# EAGLE design tick-ds3231-breakout-mk-2.1 (EAGLE 6.5.0)
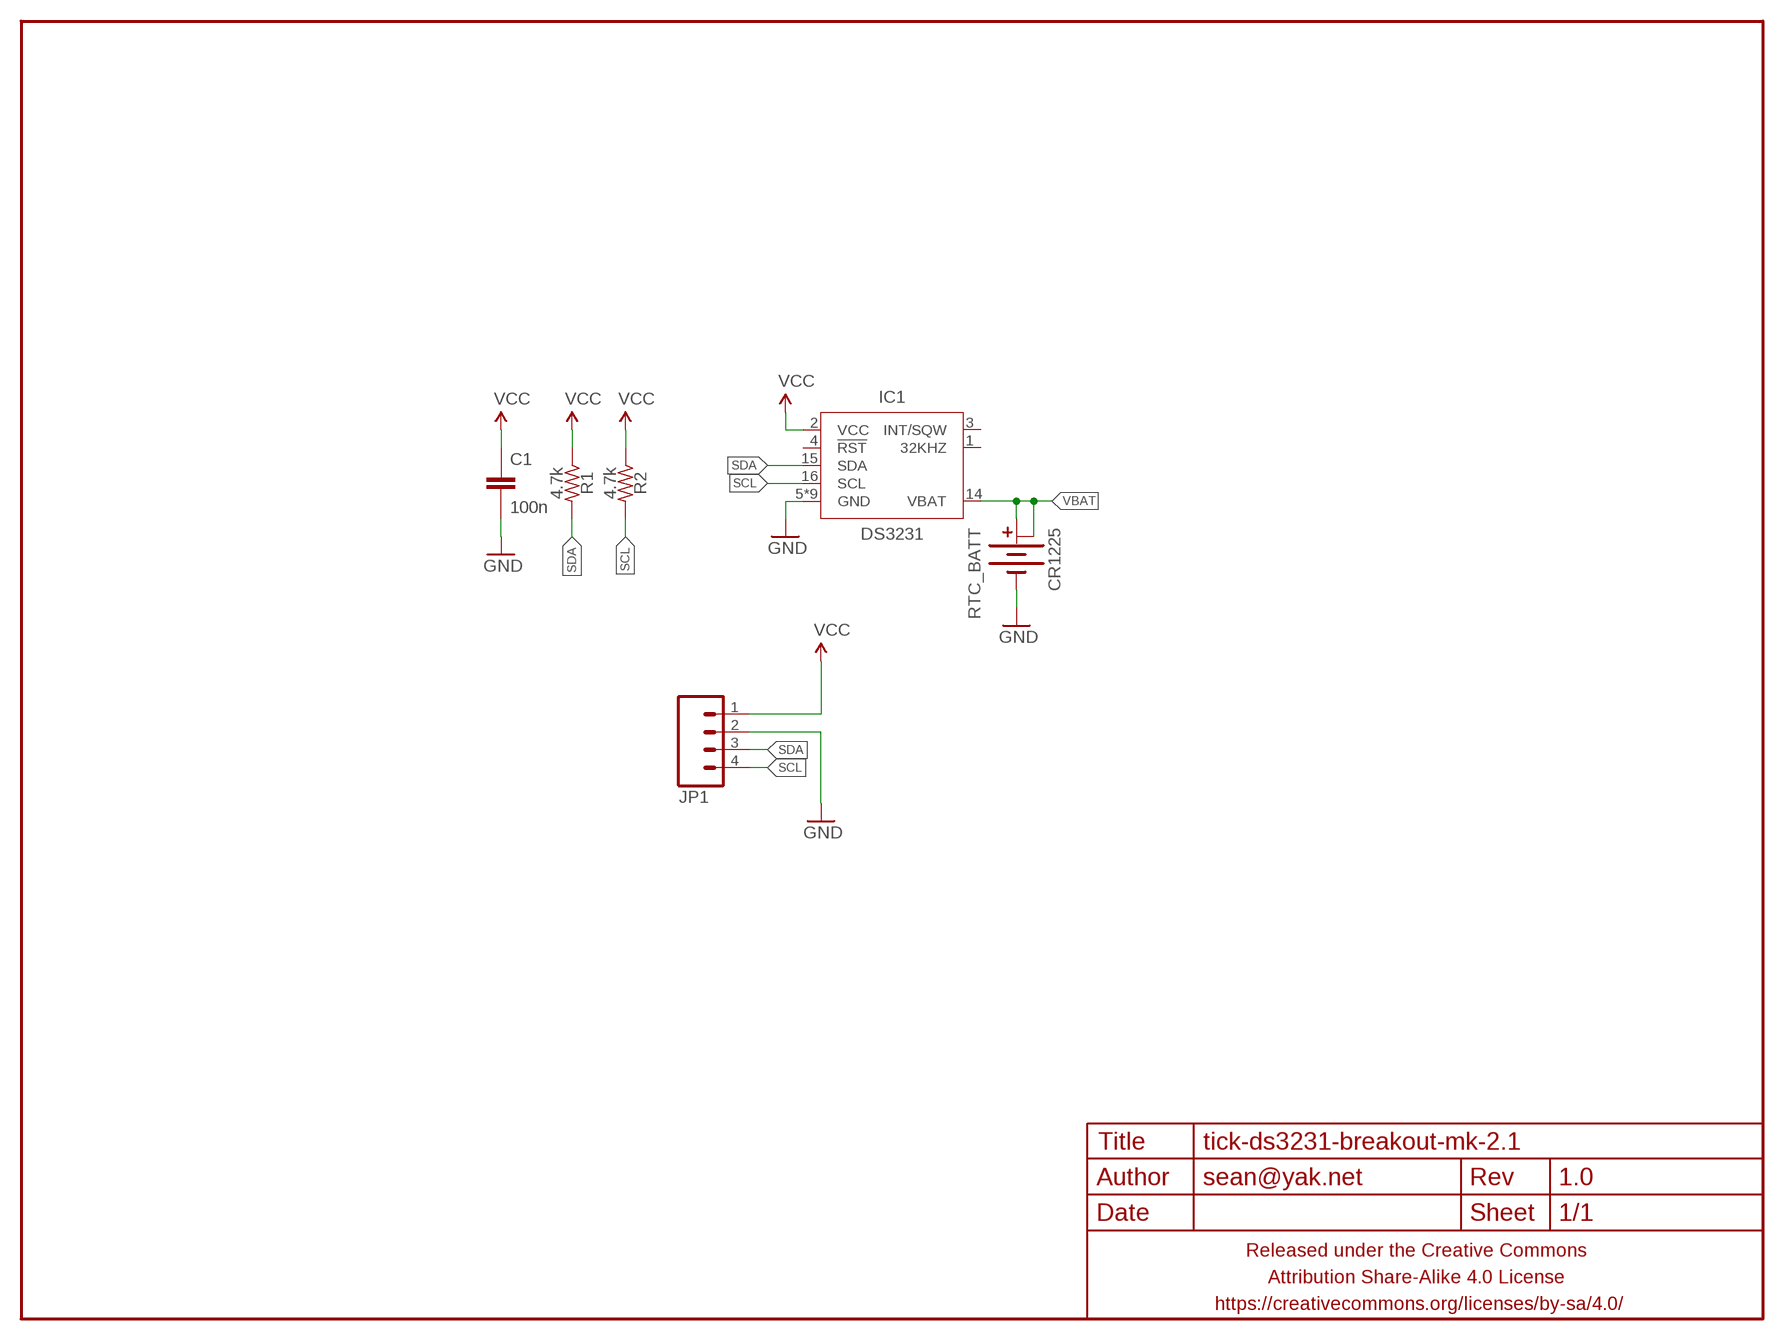
[diagram p0: schematic, sheet 1]

## Parts
C1  100n  CAPACITOR-CERAMICC0805  [C0805]
FRAME1  FRAME-LETTERNO_PACKAGE  [DUMMY]
IC1  DS3231  [SO16W]
JP1  M04PTH  [1X04-PTH-VERT]
R1  4.7k  RESISTORR0805  [R0805]
R2  4.7k  RESISTORR0805  [R0805]
RTC_BATT  CR1225  BATTERY-COINCR1225_SMD_SMALLER  [BATTCON_12MM_SMD]

## Nets
GND: C1.2 IC1.5(GND) IC1.6(GND) IC1.7(GND) IC1.8(GND) IC1.9(GND) IC1.10(GND) IC1.11(GND) IC1.12(GND) IC1.13(GND) JP1.2 RTC_BATT.-
SCL: IC1.16(SCL) JP1.4 R2.2
SDA: IC1.15(SDA) JP1.3 R1.2
VBAT: IC1.14(VBAT) RTC_BATT.+@1(+) RTC_BATT.+@2(+1)
VCC: C1.1 IC1.2(VCC) JP1.1 R1.1 R2.1
Unconnected: IC1.1(32KHZ) IC1.3(INT/SQW) IC1.4(!RST)

## Library data of the parts
C1 = A_butts:CAPACITOR-CERAMIC: CAPACITOR, European symbol
FRAME1 = A_butts:FRAME-LETTER: Schematic Frame Standard 8.5x11 US Letter frame; DESIGNER: sean@yak.net; VERSION: 1.0
IC1 = A_butts:DS3231
JP1 = A_butts:M04: Header 4 Standard 4-pin 0.1" header. Use with straight break away headers (SKU : PRT-00116), right angle break away headers (PRT-00553), swiss pins (PRT-00743), machine pins (PRT-00117), and female headers (PRT-00115). Molex polarized connector foot print use with SKU : PRT-08231 with associated crimp pins and housings. 1MM SMD Version SKU: PRT-10208
R1 R2 = A_butts:RESISTOR: RESISTOR, American symbol
RTC_BATT = A_butts:BATTERY-COIN

## Board
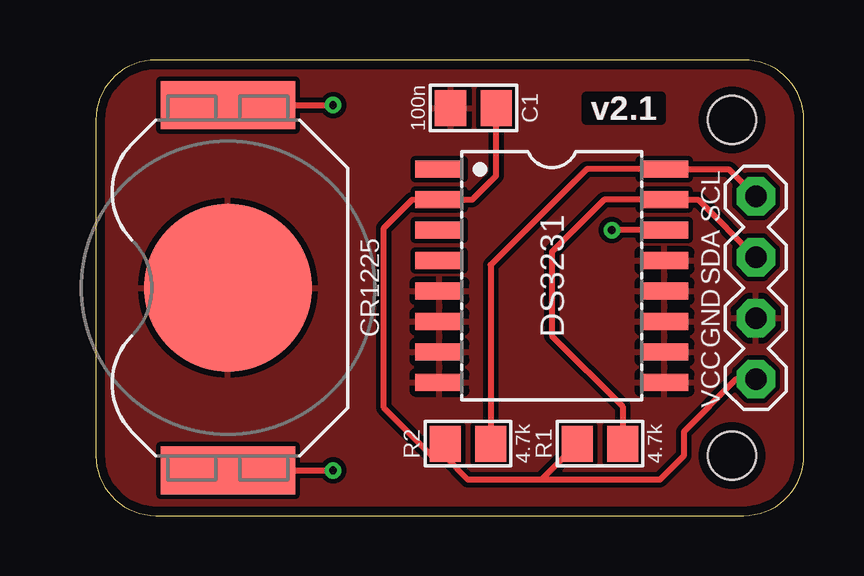
[diagram p1: board, top side]
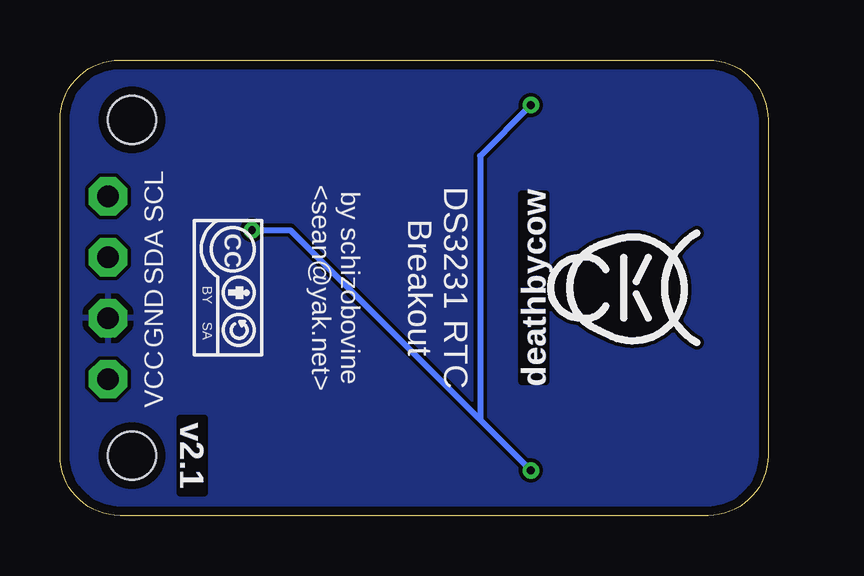
[diagram p2: board, bottom side, seen from below]

Size 29.5 x 19 mm. Coordinates in mm from the lower left corner, seen from the top.
Outline: 0,16.5 0,2.5 arc90 2.5,0 27,0 arc90 29.5,2.5 29.5,16.5 arc90 27,19 2.5,19 arc90 0,16.5
Copper layers (1*16): Top 0.0356mm / dielectric 1.5011mm / Bottom 0.0356mm
Design rules "LaenPCBOrder_2": minimum track width 6mil, minimum drill 13mil, track to track 6mil, track to pad 6mil, pad to pad 6mil, via to via 6mil, smd to smd 6mil, copper to edge 15mil, drill to drill 6mil, minimum pad ring 7mil, minimum via ring 7mil, stop-mask expansion 3mil, vias tented up to drill 20mil, thermal gap 10mil
Holes 2 mm at 26.5,2.5 26.5,16.5

### Footprints (pad centres in the part's own frame; a part is rotated, then mirrored left to right if it is on the bottom)
C0805 = smd 1.3 x 1.5: 1 -0.95,0; 2 0.95,0
SO16W = smd 0.7 x 2: 1 -4.445,-4.685; 2 -3.175,-4.685; 3 -1.905,-4.685; 4 -0.635,-4.685; 5 0.635,-4.685; 6 1.905,-4.685; 7 3.175,-4.685; 8 4.445,-4.685; 9 4.445,4.685; 10 3.175,4.685; 11 1.905,4.685; 12 0.635,4.685; 13 -0.635,4.685; 14 -1.905,4.685; 15 -3.175,4.685; 16 -4.445,4.685
1X04-PTH-VERT = drill 0.9 pad 1.6 octagon: 1 0,0; 2 2.54,0; 3 5.08,0; 4 7.62,0
R0805 = smd 1.3 x 1.5: 1 -0.95,0; 2 0.95,0
BATTCON_12MM_SMD = smd 2 x 5.6: +@1 -7.62,0; +@2 7.62,0 | smd 7 x 7: - 0,0

### Placement (x,y rotation side)
C1  15.72,17 180 top
FRAME1  0,0 0 top
IC1  19,10 270 top
JP1  27.5,5.69 90 top
R1  21,3 0 top
R2  15.5,3 0 top
RTC_BATT  5.5,9.5 270 top
U$1  [COW_SMALL_METAL]  5.5,9.5 270 bottom
U$2  [CC-BY-SA-4.0-NO-URL]  22.5,9.5 270 bottom

### Tracks (layer width: path | path; a pad name or v marks a point on that pad's centre or on a via)
GND
  pour Top (isolate 0.2): 29.5,19 29.5,0 0,0 0,19
  pour Bottom: 0,0 0,19 29.5,19 29.5,0
SCL
  Top 0.25: R2.2 16.45,10.45 20.45,14.45 IC1.16 26.36,14.45 JP1.4
SDA
  Top 0.25: R1.2 21.95,4.55 19,7.5 19,11 21.18,13.18 IC1.15 25.09,13.18 JP1.3
VBAT  (via drill 0.33)
  Top 0.25: RTC_BATT.+@1 v9.88,17.12 | RTC_BATT.+@2 v9.88,1.88 | IC1.14 v21.5,11.9
  Bottom 0.25: v9.88,17.12 12,15 12,4 | v21.5,11.9 19.91,11.9 12,4 | 12,4 v9.88,1.88
VCC
  Top 0.25: C1.1 16.68,14.18 15.68,13.18 IC1.2 13.18,13.18 12,12 12,4.5 14,2.5 R2.1 14.55,2.45 15.5,1.5 18.55,1.5 | R1.1 18.55,1.5 | JP1.1 26.69,5.69 24.5,3.5 24.5,2.5 23.5,1.5 18.55,1.5

### Text on the board
tPlace: SCL | SDA | GND | VCC
bPlace: SCL | SDA | DS3231 RTC / Breakout | by schizobovine / <sean@yak.net> | GND | VCC